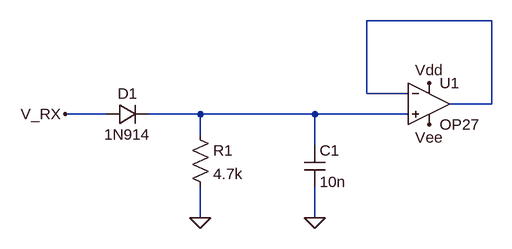
[diagram p0: schematic Draft7.asc]
Draft7.asc, the LTspice schematic file:
Version 4
SHEET 1 880 680
WIRE 864 32 672 32
WIRE 672 144 672 32
WIRE 736 144 672 144
WIRE 864 160 864 32
WIRE 864 160 800 160
WIRE 272 176 208 176
WIRE 416 176 336 176
WIRE 592 176 416 176
WIRE 736 176 592 176
WIRE 416 208 416 176
WIRE 592 224 592 176
WIRE 416 336 416 288
WIRE 592 336 592 288
FLAG 208 176 V_RX
FLAG 416 336 0
FLAG 768 128 Vdd
FLAG 768 192 Vee
FLAG 592 336 0
SYMBOL diode 272 192 R270
WINDOW 0 32 32 VTop 2
WINDOW 3 0 32 VBottom 2
SYMATTR InstName D1
SYMATTR Value 1N914
SYMBOL res 400 192 R0
SYMATTR InstName R1
SYMATTR Value 4.7k
SYMBOL cap 576 224 R0
SYMATTR InstName C1
SYMATTR Value 10n
SYMBOL Opamps\\OP27 768 96 R0
SYMATTR InstName U1

The netlist it stands for:
* Draft7.asc
D1 V_RX N002 1N914
R1 N002 0 4.7k
C1 N002 0 10n
XU1 N002 N001 Vdd Vee N001 OP27  ; pins In+ In- V+ V- OUT
.model D D
.lib standard.dio
.lib ADI.lib
.backanno
.end